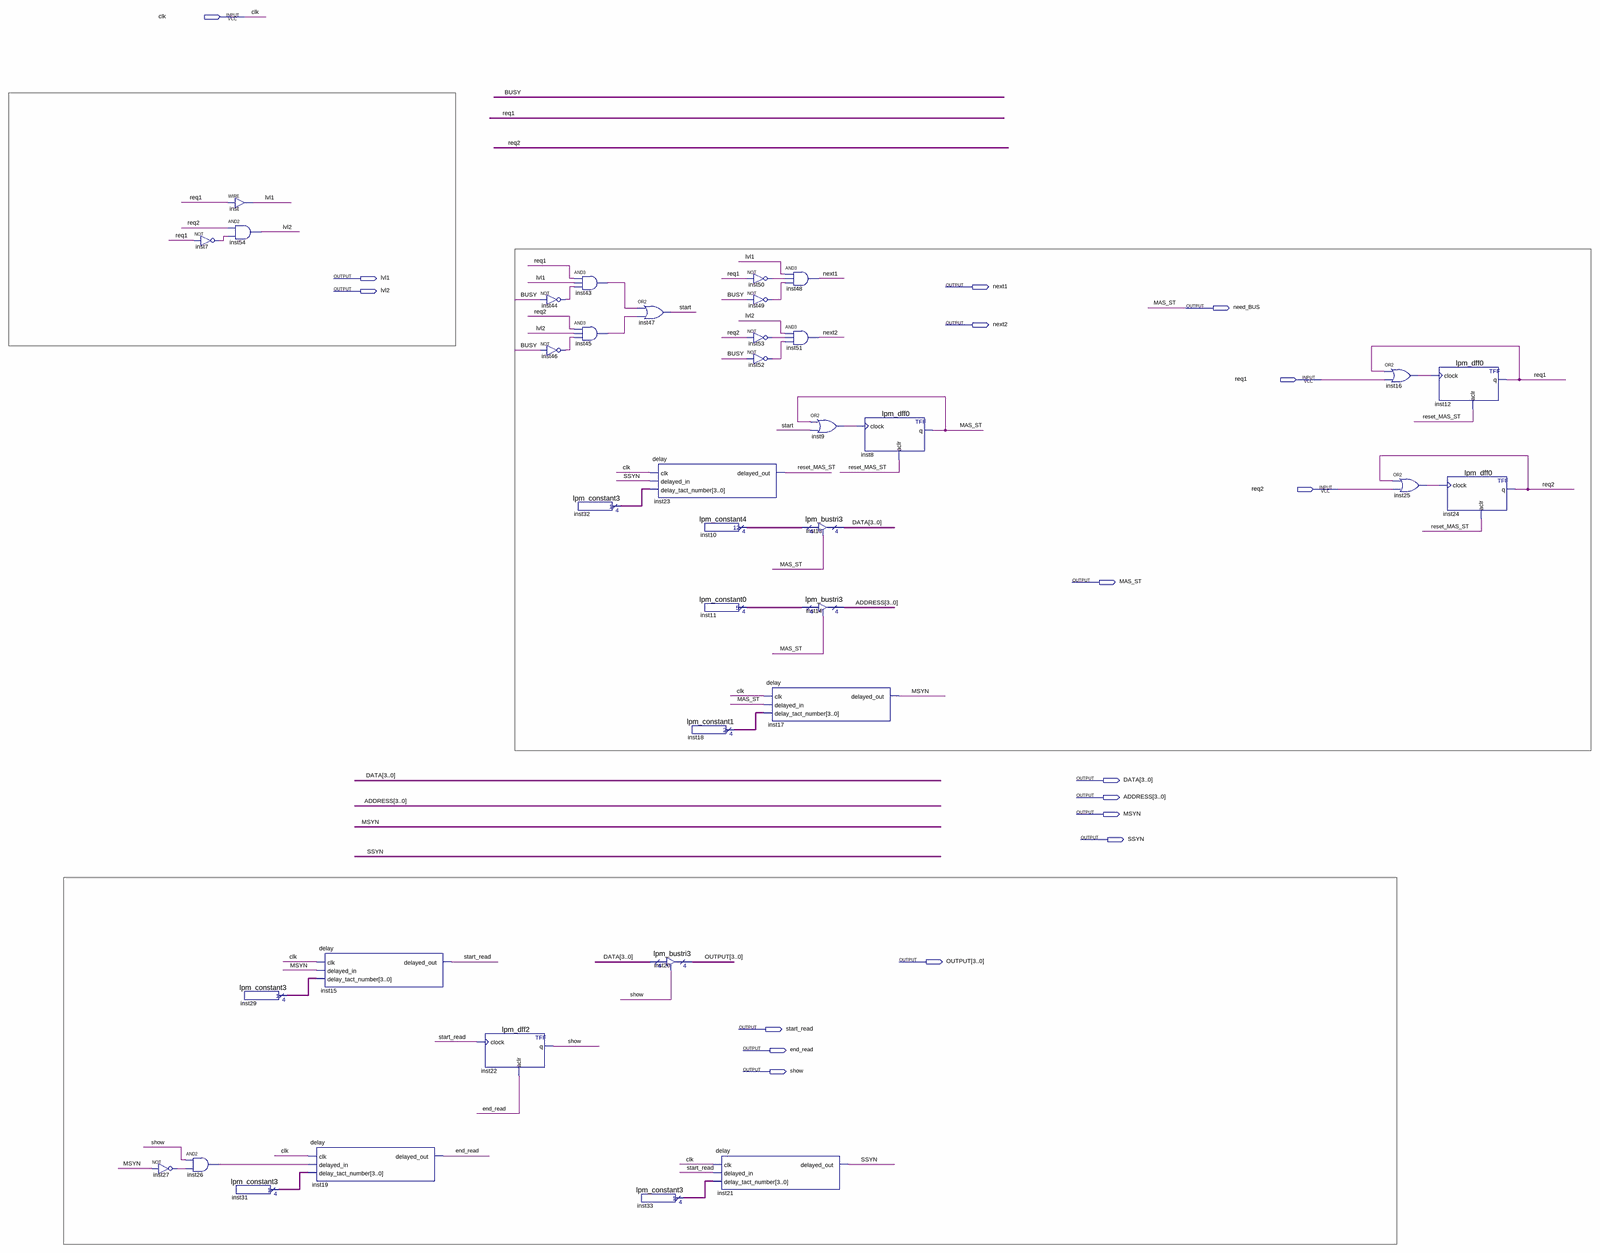
[diagram p0: schematic sheet, whole]
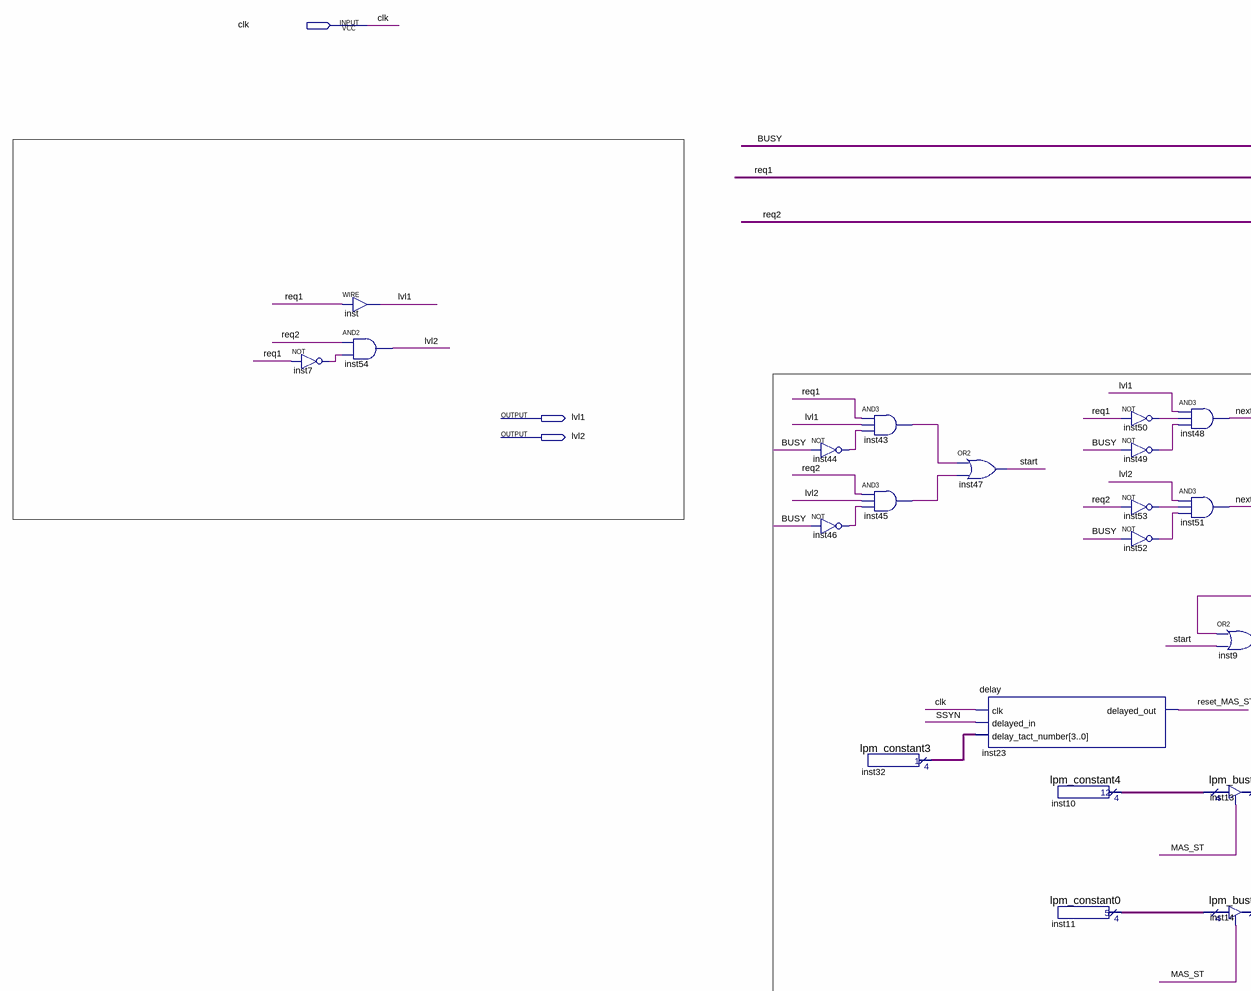
[diagram p1: schematic sheet, upper left part]
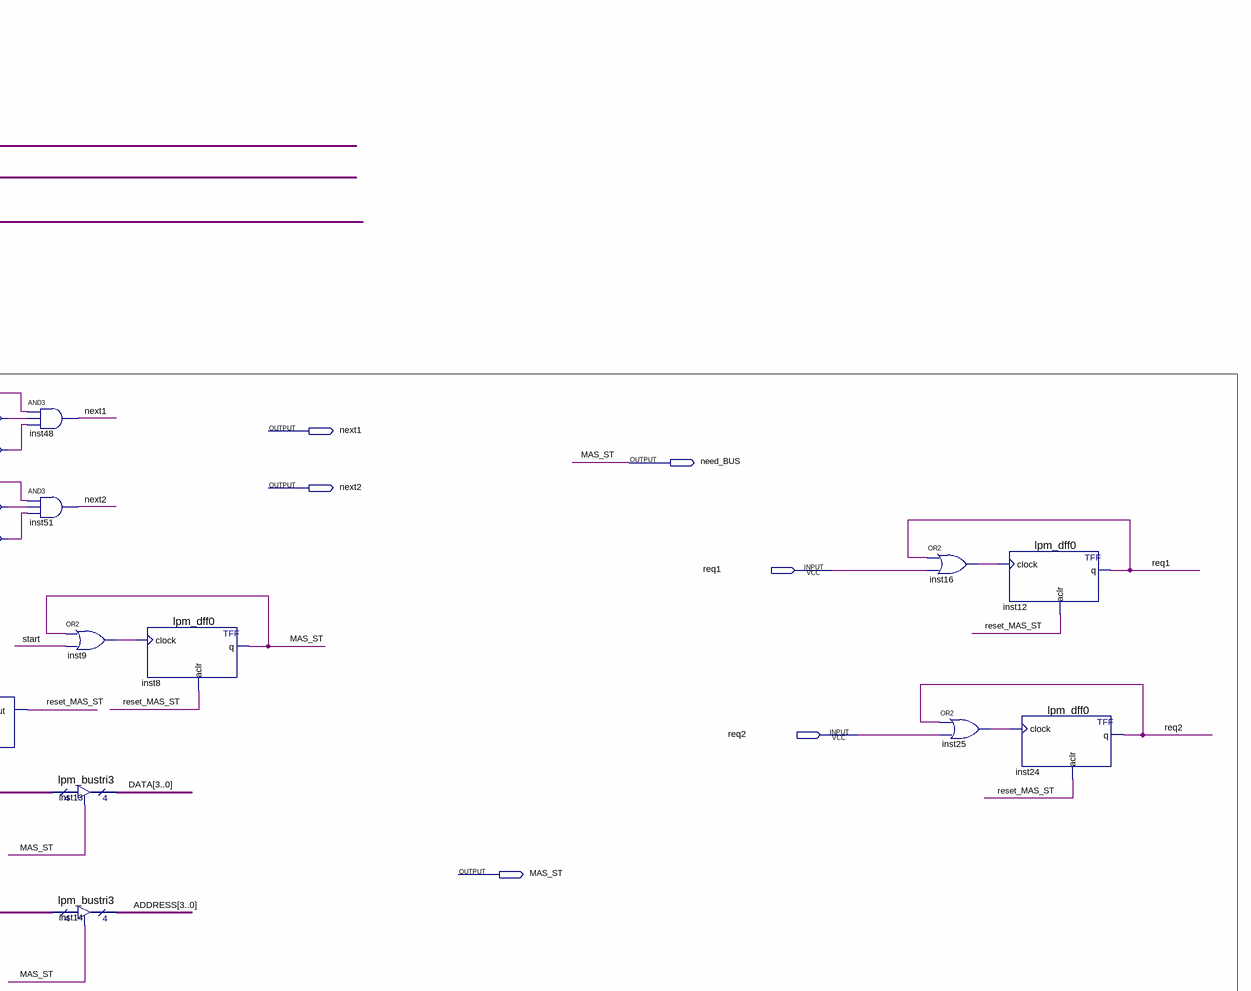
[diagram p2: schematic sheet, upper right part]
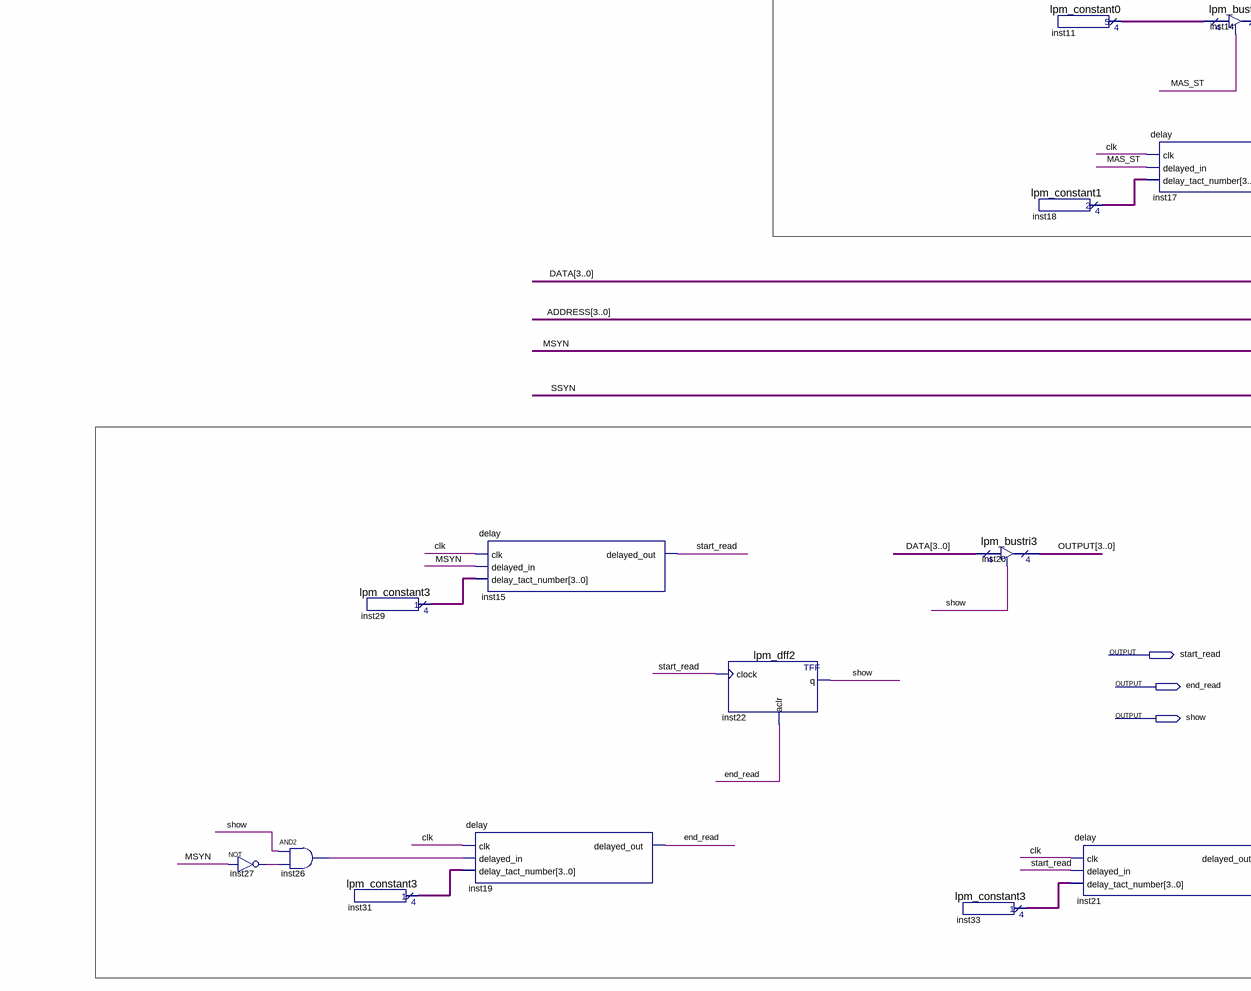
[diagram p3: schematic sheet, lower left part]
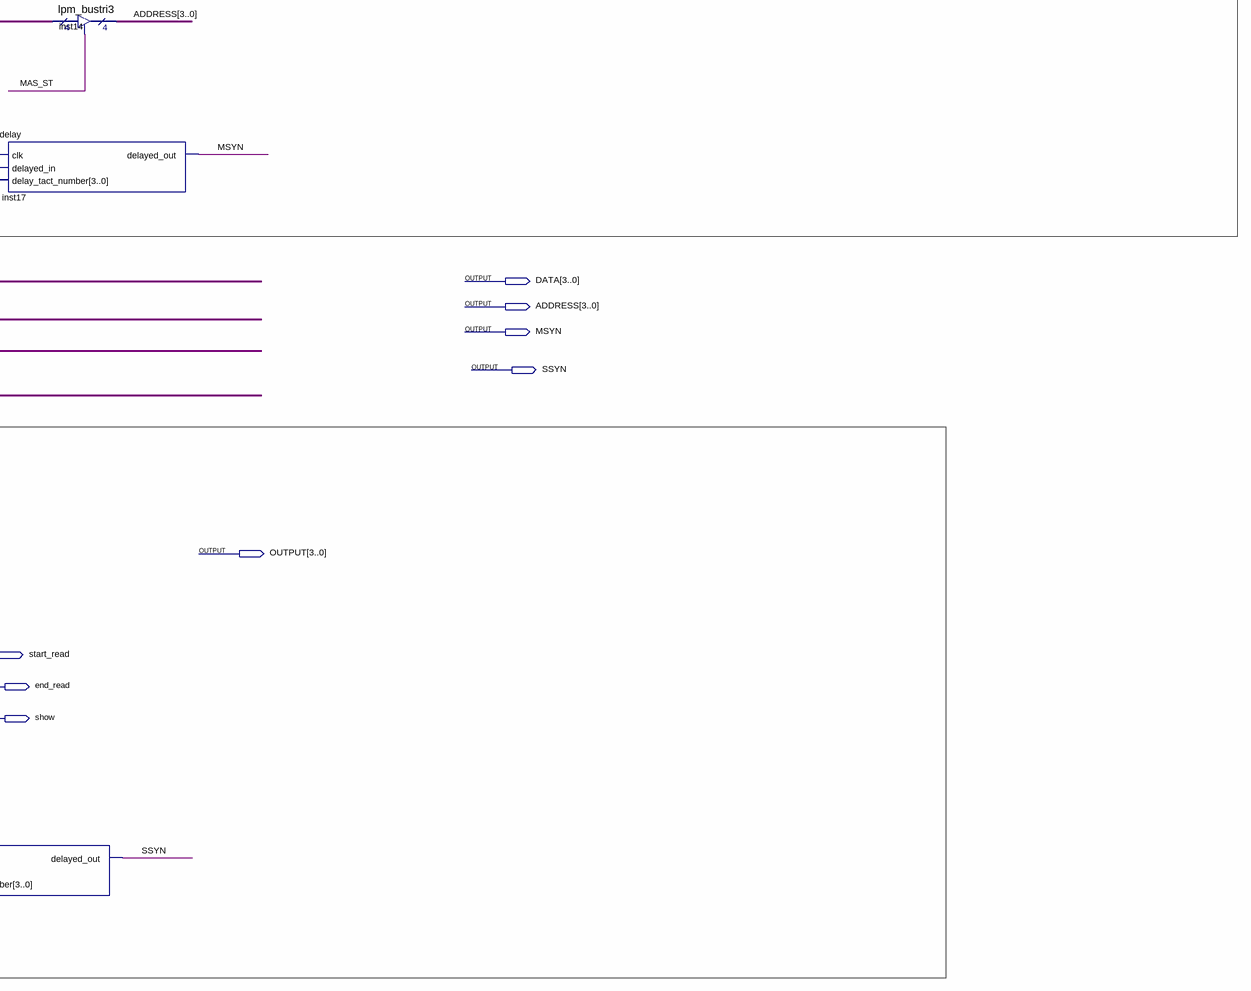
[diagram p4: schematic sheet, lower right part]
// Quartus schematic result.bdf as structural Verilog: 38 symbols, 17 pins
module result (
  input  clk,
  input  req1,
  input  req2,
  output lvl1,
  output next1,
  output lvl2,
  output need_BUS,
  output next2,
  output MAS_ST,
  output [3:0] DATA,
  output [3:0] ADDRESS,
  output MSYN,
  output SSYN,
  output [3:0] OUTPUT,
  output start_read,
  output end_read,
  output show
);

  wire BUSY, inst7_out, inst9_out, inst16_out, inst25_out, inst26_out, inst27_out, inst43_out, inst44_out,
       inst45_out, inst46_out, inst49_out, inst50_out, inst52_out, inst53_out, reset_MAS_ST, start;
  wire [3:0] inst10_result, inst11_result, inst18_result, inst29_result, inst31_result, inst32_result,
       inst33_result;

  not inst27 (inst27_out, MSYN);
  not inst7 (inst7_out, req1);
  and inst26 (inst26_out, show, inst27_out);
  assign lvl1 = req1;  // WIRE inst
  and inst54 (lvl2, req2, inst7_out);
  lpm_constant3 inst31 (.result(inst31_result));
  lpm_constant3 inst29 (.result(inst29_result));
  delay inst15 (.clk(clk), .delayed_in(MSYN), .delay_tact_number(inst29_result), .delayed_out(start_read));
  delay inst19 (.clk(clk), .delayed_in(inst26_out), .delay_tact_number(inst31_result), .delayed_out(end_read));
  lpm_dff2 inst22 (.clock(start_read), .aclr(end_read), .q(show));
  not inst44 (inst44_out, BUSY);
  not inst46 (inst46_out, BUSY);
  lpm_constant3 inst32 (.result(inst32_result));
  and inst43 (inst43_out, req1, lvl1, inst44_out);
  and inst45 (inst45_out, req2, lvl2, inst46_out);
  or inst47 (start, inst43_out, inst45_out);
  lpm_constant3 inst33 (.result(inst33_result));
  delay inst23 (.clk(clk), .delayed_in(SSYN), .delay_tact_number(inst32_result), .delayed_out(reset_MAS_ST));
  lpm_bustri3 inst20 (.enabledt(show), .data(DATA), .tridata(OUTPUT));
  lpm_constant4 inst10 (.result(inst10_result));
  lpm_constant0 inst11 (.result(inst11_result));
  lpm_constant1 inst18 (.result(inst18_result));
  delay inst21 (.clk(clk), .delayed_in(start_read), .delay_tact_number(inst33_result), .delayed_out(SSYN));
  not inst50 (inst50_out, req1);
  not inst49 (inst49_out, BUSY);
  not inst53 (inst53_out, req2);
  not inst52 (inst52_out, BUSY);
  delay inst17 (.clk(clk), .delayed_in(MAS_ST), .delay_tact_number(inst18_result), .delayed_out(MSYN));
  and inst48 (next1, lvl1, inst50_out, inst49_out);
  and inst51 (next2, lvl2, inst53_out, inst52_out);
  lpm_bustri3 inst13 (.enabledt(MAS_ST), .data(inst10_result), .tridata(DATA));
  lpm_bustri3 inst14 (.enabledt(MAS_ST), .data(inst11_result), .tridata(ADDRESS));
  or inst9 (inst9_out, MAS_ST, start);
  lpm_dff0 inst8 (.clock(inst9_out), .aclr(reset_MAS_ST), .q(MAS_ST));
  or inst16 (inst16_out, req1, req1);
  or inst25 (inst25_out, req2, req2);
  lpm_dff0 inst12 (.clock(inst16_out), .aclr(reset_MAS_ST), .q(req1));
  lpm_dff0 inst24 (.clock(inst25_out), .aclr(reset_MAS_ST), .q(req2));

  assign need_BUS = MAS_ST;
endmodule
